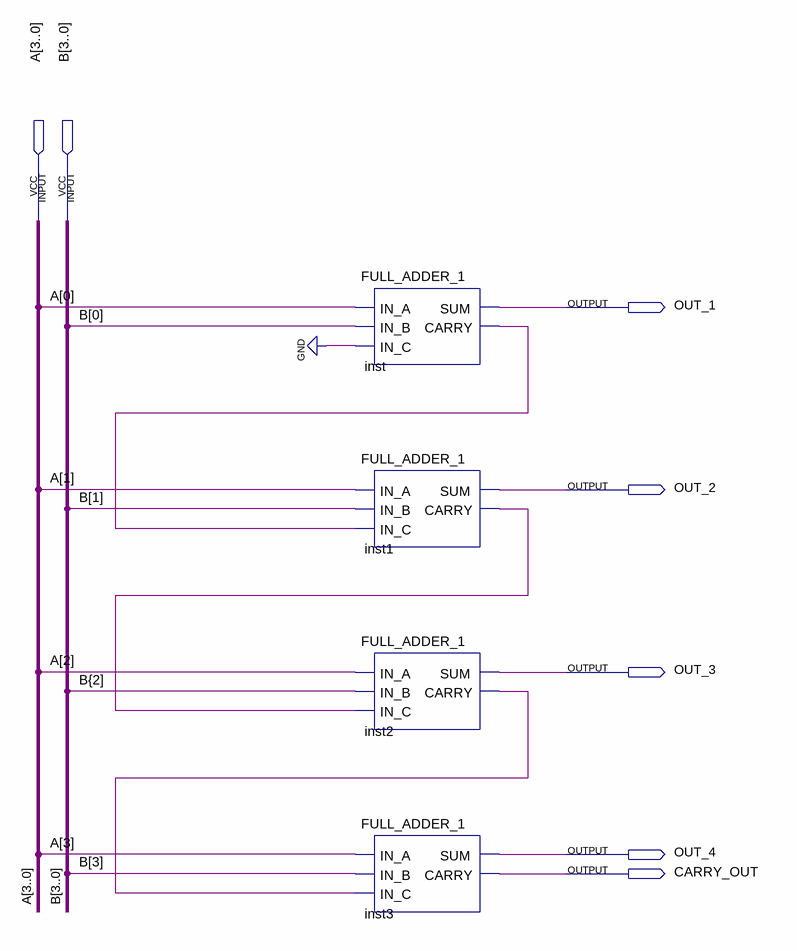
[diagram p0: schematic sheet]
// Quartus schematic ADDITION_BUST.bdf as structural Verilog: 4 symbols, 7 pins
module ADDITION_BUST (
  input  [3:0] A,
  input  [3:0] B,
  output OUT_1,
  output OUT_2,
  output OUT_3,
  output OUT_4,
  output CARRY_OUT
);

  wire \B{2] , inst1_carry, inst2_carry, inst_carry;

  FULL_ADDER_1 inst (.IN_A(A[0]), .IN_B(B[0]), .IN_C(1'b0), .SUM(OUT_1), .CARRY(inst_carry));
  FULL_ADDER_1 inst1 (.IN_A(A[1]), .IN_B(B[1]), .IN_C(inst_carry), .SUM(OUT_2), .CARRY(inst1_carry));
  FULL_ADDER_1 inst2 (.IN_A(A[2]), .IN_B(\B{2] ), .IN_C(inst1_carry), .SUM(OUT_3), .CARRY(inst2_carry));
  FULL_ADDER_1 inst3 (.IN_A(A[3]), .IN_B(B[3]), .IN_C(inst2_carry), .SUM(OUT_4), .CARRY(CARRY_OUT));
endmodule
